# EAGLE design schematic (EAGLE 6.5.0)
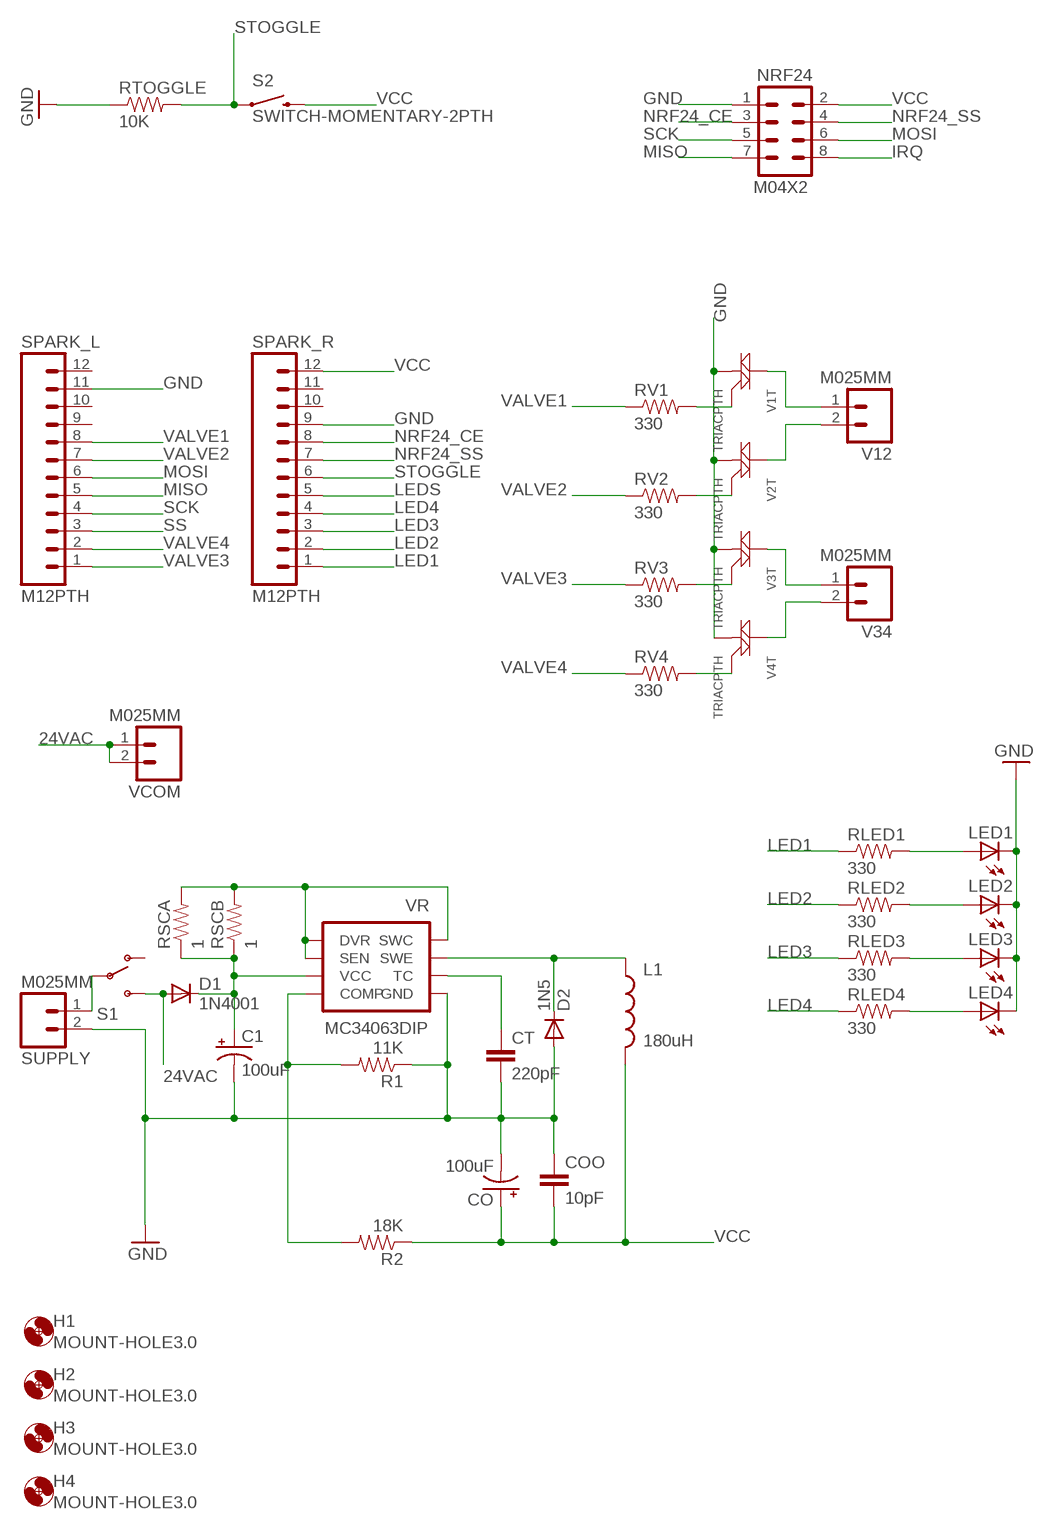
[diagram p0: schematic, sheet 1]

## Parts
C1  100uF  CPOL-USE3.5-8  [E3,5-8]
CO  100uF  CAP_POLPTH1  [CPOL-RADIAL-100UF-25V]
COO  10pF  CAPPTH1  [CAP-PTH-5MM]
CT  220pF  CAPPTH1  [CAP-PTH-5MM]
D1  1N4001  DIODEPTH  [DIODE-1N4001]
D2  1N5  DIODEPTH  [DIODE-1N4001]
H1  MOUNT-HOLE3.0  [3,0]
H2  MOUNT-HOLE3.0  [3,0]
H3  MOUNT-HOLE3.0  [3,0]
H4  MOUNT-HOLE3.0  [3,0]
L1  180uH  INDUCTORRLB0912  [RLB0912]
LED1  LED3MM  [LED3MM]
LED2  LED3MM  [LED3MM]
LED3  LED3MM  [LED3MM]
LED4  LED3MM  [LED3MM]
NRF24  M04X2  [2X4]
R1  11K  RESISTORAXIAL-0.3  [AXIAL-0.3]
R2  18K  RESISTORAXIAL-0.3  [AXIAL-0.3]
RLED1  330  RESISTORAXIAL-0.3  [AXIAL-0.3]
RLED2  330  RESISTORAXIAL-0.3  [AXIAL-0.3]
RLED3  330  RESISTORAXIAL-0.3  [AXIAL-0.3]
RLED4  330  RESISTORAXIAL-0.3  [AXIAL-0.3]
RSCA  1  RESISTORAXIAL-0.3  [AXIAL-0.3]
RSCB  1  RESISTORAXIAL-0.3  [AXIAL-0.3]
RTOGGLE  10K  RESISTORAXIAL-0.3  [AXIAL-0.3]
RV1  330  RESISTORAXIAL-0.3  [AXIAL-0.3]
RV2  330  RESISTORAXIAL-0.3  [AXIAL-0.3]
RV3  330  RESISTORAXIAL-0.3  [AXIAL-0.3]
RV4  330  RESISTORAXIAL-0.3  [AXIAL-0.3]
S1  SWITCH-SPDTPTH  [SWITCH-SPDT]
S2  SWITCH-MOMENTARY-2PTH  [TACTILE-PTH]
SPARK_L  M12PTH  [1X12]
SPARK_R  M12PTH  [1X12]
SUPPLY  M025MM  [SCREWTERMINAL-5MM-2]
V1T  TRIACPTH  [TO-92]
V2T  TRIACPTH  [TO-92]
V3T  TRIACPTH  [TO-92]
V4T  TRIACPTH  [TO-92]
V12  M025MM  [SCREWTERMINAL-5MM-2]
V34  M025MM  [SCREWTERMINAL-5MM-2]
VCOM  M025MM  [SCREWTERMINAL-5MM-2]
VR  MC34063DIP  [DIP-08]

## Nets
24VAC [24vac]: D1.A S1.3(S) VCOM.1 VCOM.2
GND [24vac]: C1.- CO.2(-) COO.1 CT.2 D2.A LED1.K(C) LED2.K(C) LED3.K(C) LED4.K(C) NRF24.1 R1.P$1 RTOGGLE.P$1 SPARK_L.11 SPARK_R.9 SUPPLY.2 V1T.1(M1) V2T.1(M1) V3T.1(M1) V4T.1(M1) VR.4(GND)
IRQ: NRF24.8
LED1: RLED1.P$1 SPARK_R.1
LED2: RLED2.P$1 SPARK_R.2
LED3: RLED3.P$1 SPARK_R.3
LED4: RLED4.P$1 SPARK_R.4
LEDS: SPARK_R.5
MISO: NRF24.7 SPARK_L.5
MOSI: NRF24.6 SPARK_L.6
N$1 [24vac]: S1.2(P) SUPPLY.1
N$2 [24vac]: V1T.3(M2) V12.1
N$3 [24vac]: C1.+ D1.C RSCA.P$1 RSCB.P$1 VR.6(VCC)
N$4: D2.C L1.1 VR.2(SWE)
N$5 [24vac]: RSCA.P$2 RSCB.P$2 VR.1(SWC) VR.7(SEN) VR.8(DVR)
N$6: CT.1 VR.3(TC)
N$8: R1.P$2 R2.P$2 VR.5(COMP)
N$11: RV1.P$2 V1T.2(G)
N$12 [24vac]: V2T.3(M2) V12.2
N$13: RV2.P$2 V2T.2(G)
N$14 [24vac]: V3T.3(M2) V34.1
N$15 [24vac]: V4T.3(M2) V34.2
N$16: RV3.P$2 V3T.2(G)
N$17: RV4.P$2 V4T.2(G)
N$18: LED1.A RLED1.P$2
N$19: LED2.A RLED2.P$2
N$20: LED3.A RLED3.P$2
N$21: LED4.A RLED4.P$2
NRF24_CE: NRF24.3 SPARK_R.8
NRF24_SS: NRF24.4 SPARK_R.7
SCK: NRF24.5 SPARK_L.4
SS: SPARK_L.3
STOGGLE: RTOGGLE.P$2 S2.1 SPARK_R.6
VALVE1: RV1.P$1 SPARK_L.8
VALVE2: RV2.P$1 SPARK_L.7
VALVE3: RV3.P$1 SPARK_L.1
VALVE4: RV4.P$1 SPARK_L.2
VCC: CO.1(+) COO.2 L1.2 NRF24.2 R2.P$1 S2.3 SPARK_R.12
Unconnected: S1.1(O) SPARK_L.9 SPARK_L.10 SPARK_L.12 SPARK_R.10 SPARK_R.11

## Library data of the parts
C1 = resistor:CPOL-US: POLARIZED CAPACITOR, American symbol
CO = SparkFun-Passives:CAP_POL: Capacitor Polarized These are standard SMD and PTH capacitors. Normally 10uF, 47uF, and 100uF in electrolytic and tantalum varieties. Always verify the external diameter of the through hole cap, it varies with capacity, voltage, and manufacturer. The EIA devices should be standard.
COO CT = SparkFun-Capacitors:CAP: Capacitor Standard 0603 ceramic capacitor, and 0.1" leaded capacitor.
D1 D2 = SparkFun-DiscreteSemi:DIODE: Diode These are standard reverse protection diodes and small signal diodes. SMA package can handle up to about 1A. SOD-323 can handle about 200mA. What the SOD-323 package when ordering, there are some mfgs out there that are 5-pin packages.
H1-H4 = holes:MOUNT-HOLE: MOUNTING HOLE with drill center marker
L1 = SparkFun-Passives:INDUCTOR: Inductors Basic Inductor/Choke - 0603 and 1206. Footprints are not proven and vary greatly between part numbers. SRN6045- 33uH, 20% 1.4A SDR0403-560KL - 56uH, 10%, 500mA RMS/740mA peak
LED1-LED4 = SparkFun-LED:LED: LEDs Standard schematic elements and footprints for 5mm, 3mm, 1206, and 0603 sized LEDs. 5mm - Spark Fun Electronics SKU : COM-00529 (and others)
NRF24 = SparkFun-Connectors:M04X2: .1" header, two rows of four.
R1 R2 RLED1-RLED4 RSCA RSCB RTOGGLE RV1-RV4 = SparkFun-Passives:RESISTOR: Resistor Basic schematic elements and footprints for 0603, 1206, and PTH resistors.
S1 = SparkFun-Electromechanical:SWITCH-SPDT: SPDT Switch Simple slide switch, Spark Fun Electronics SKU : COM-00102 DPDT SMT slide switch, AYZ0202, SWCH-08179
S2 = SparkFun-Electromechanical:SWITCH-MOMENTARY-2: Various NO switches- pushbuttons, reed, etc
SPARK_L SPARK_R = SparkFun-Connectors:M12: Header 12 Standard 12-pin 0.1" header. Use with straight break away headers (SKU : PRT-00116), right angle break away headers (PRT-00553), swiss pins (PRT-00743), machine pins (PRT-00117), and female headers (PRT-00115).
SUPPLY V12 V34 VCOM = SparkFun-Connectors:M02: Standard 2-pin 0.1" header. Use with - straight break away headers ( PRT-00116) - right angle break away headers (PRT-00553) - swiss pins (PRT-00743) - machine pins (PRT-00117) - female headers (PRT-00115) Molex polarized connector foot print use with: PRT-08233 with associated crimp pins and housings. 2.54_SCREWTERM for use with PRT-10571. 3.5mm Screw Terminal footprints for PRT-08084 5mm Screw Terminal footprints for use with PRT-08433
V1T V2T V3T V4T = SparkFun-DiscreteSemi:TRIAC: Low-power generic TRIAC packages
VR = SparkFun-PowerIC:MC34063: Jellybean switching supply controller

## Net classes
0 default: width 0.152 mm, clearance 0.152 mm
1 24vac: width 0.813 mm, clearance 0.406 mm

## Board
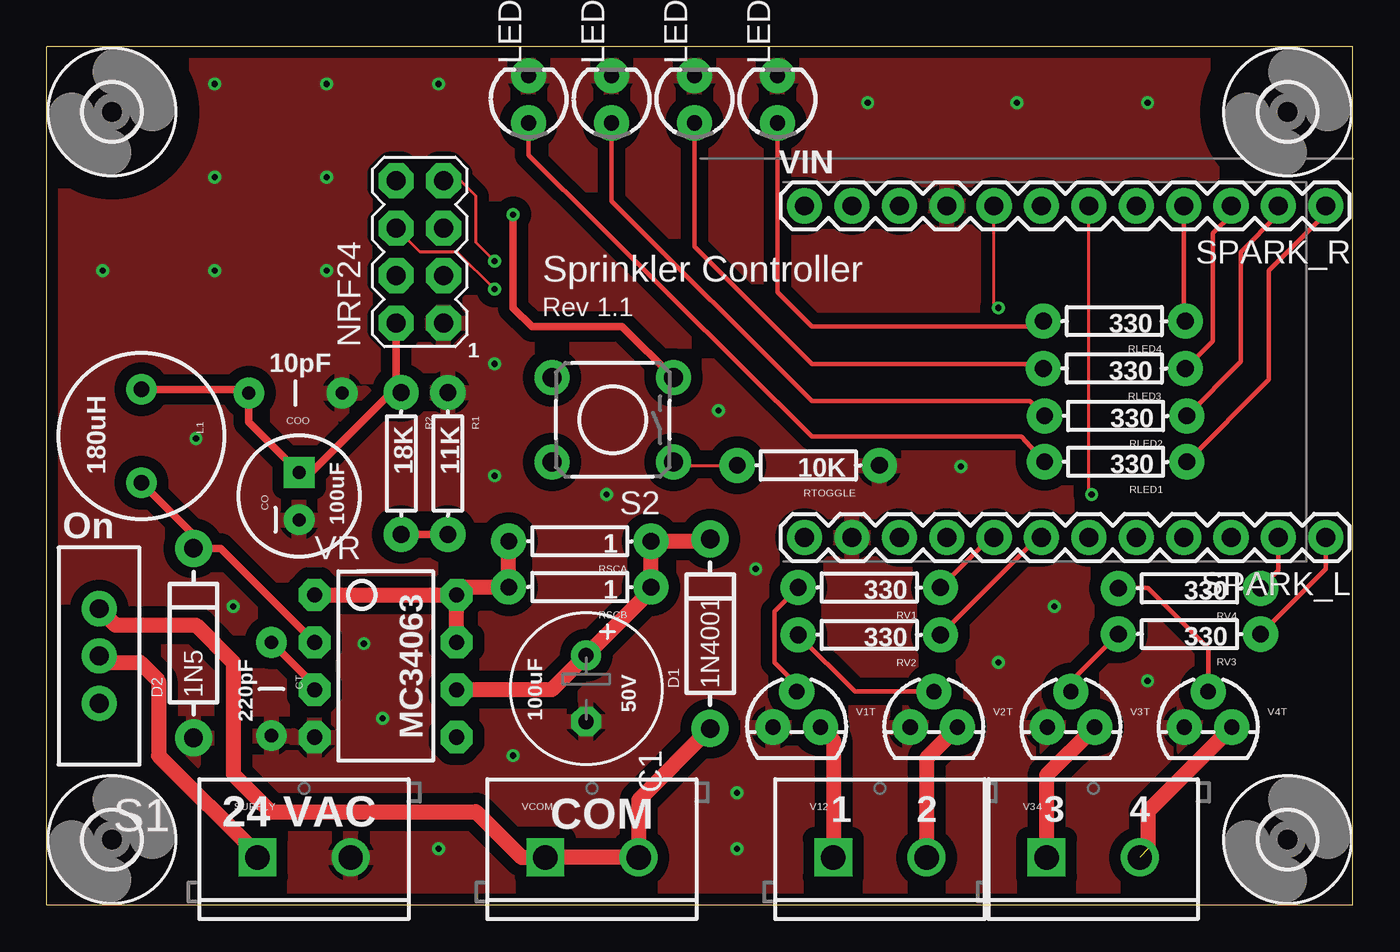
[diagram p1: board, top side]
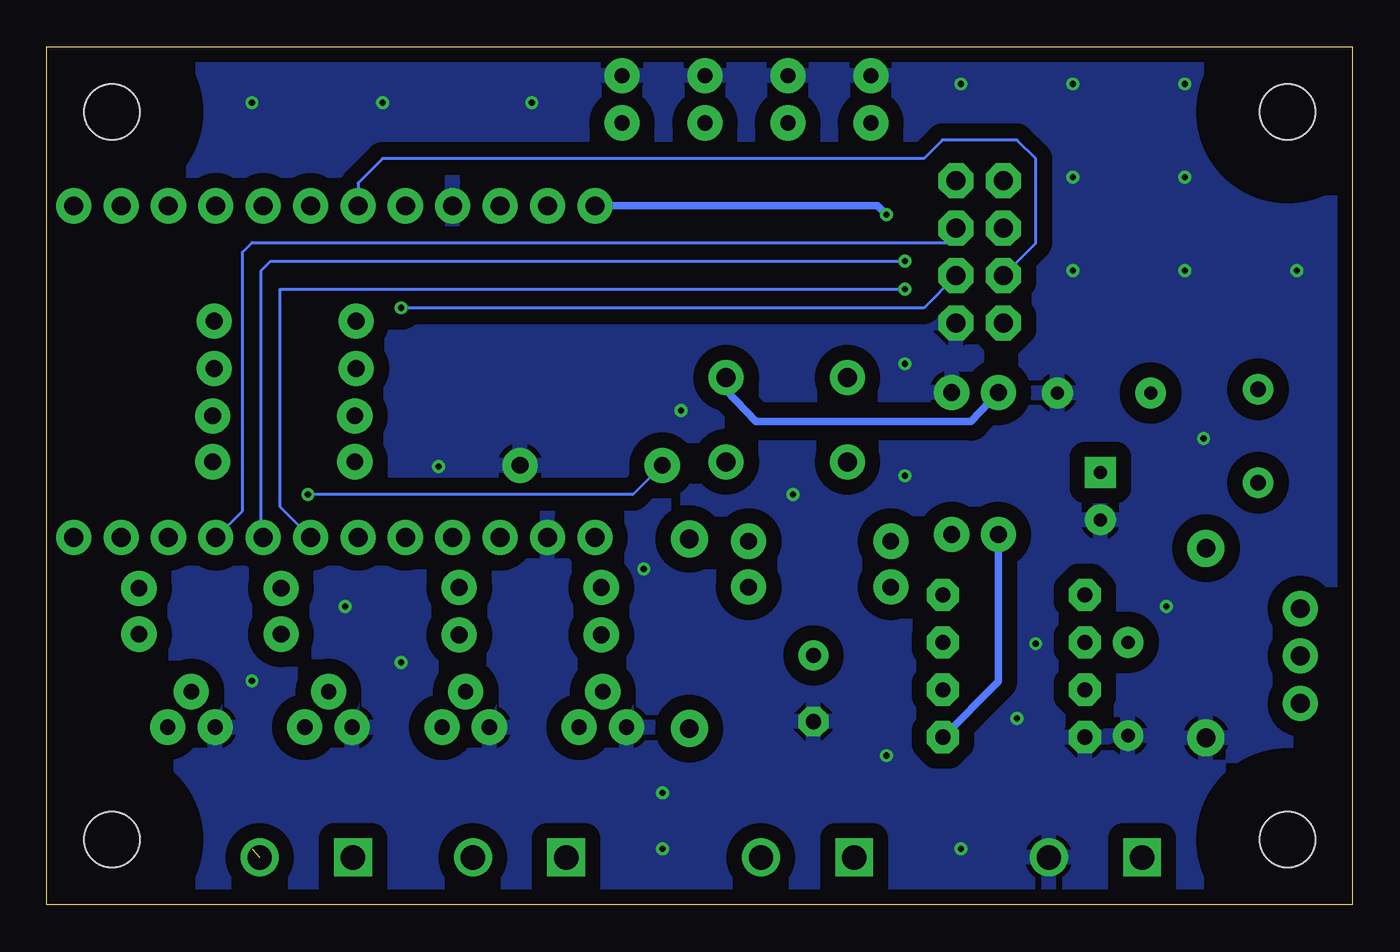
[diagram p2: board, bottom side, seen from below]

Size 70 x 46 mm. Coordinates in mm from the lower left corner, seen from the top.
Outline: 0,0 70,0 70,46 0,46 0,0
Copper layers (1*16): Top 0.0356mm / dielectric 1.5011mm / Bottom 0.0356mm
Design rules "LaenPCBOrder *": minimum track width 6mil, minimum drill 13mil, track to track 6mil, track to pad 6mil, pad to pad 6mil, via to via 6mil, smd to smd 6mil, copper to edge 15mil, drill to drill 6mil, minimum pad ring 7mil, minimum via ring 7mil, stop-mask expansion 3mil, vias tented up to drill 0mil, thermal gap 10mil

### Footprints (pad centres in the part's own frame; a part is rotated, then mirrored left to right if it is on the bottom)
E3,5-8 = drill 0.813 pad 1.6: + -1.778,0 | drill 0.813 pad 1.6 octagon: - 1.778,0
CPOL-RADIAL-100UF-25V = drill 0.7 pad 1.651 square: 1 1.27,0 | drill 0.7 pad 1.651: 2 -1.27,0
CAP-PTH-5MM = drill 0.7 pad 1.651: 1 -2.5,0; 2 2.5,0
DIODE-1N4001 = drill 1 pad 1.981: A -5.08,0; C 5.08,0
3,0 = hole 3: 0,0
RLB0912 = drill 0.813 pad 1.651: 1 2.502,0; 2 -2.502,0
LED3MM = drill 0.813 pad 1.88: A -1.27,0; K 1.27,0
2X4 = drill 1.016 pad 1.88 octagon: 1 -3.81,-1.27; 2 -3.81,1.27; 3 -1.27,-1.27; 4 -1.27,1.27; 5 1.27,-1.27; 6 1.27,1.27; 7 3.81,-1.27; 8 3.81,1.27
AXIAL-0.3 = drill 0.9 pad 1.88: P$1 -3.81,0; P$2 3.81,0
SWITCH-SPDT = drill 1.016 pad 1.88: 1 0,2.54; 2 0,0; 3 0,-2.54
TACTILE-PTH = drill 1.016 pad 1.88: 1 -3.251,2.261; 2 3.251,2.261; 3 -3.251,-2.261; 4 3.251,-2.261
1X12 = drill 1.016 pad 1.88: 1 0,0; 2 2.54,0; 3 5.08,0; 4 7.62,0; 5 10.16,0; 6 12.7,0; 7 15.24,0; 8 17.78,0; 9 20.32,0; 10 22.86,0; 11 25.4,0; 12 27.94,0
SCREWTERMINAL-5MM-2 = drill 1.3 pad 2.032 square: 1 0,0 | drill 1.3 pad 2.032: 2 5,0
TO-92 = drill 0.813 pad 1.88: 1 -1.27,0; 2 0,1.905; 3 1.27,0
DIP-08 = drill 0.813 pad 1.727 octagon: 1 -3.81,-3.81; 2 -1.27,-3.81; 3 1.27,-3.81; 4 3.81,-3.81; 5 3.81,3.81; 6 1.27,3.81; 7 -1.27,3.81; 8 -3.81,3.81

### Placement (x,y rotation side)
C1  28.91,11.6 270 top
CO  13.53,21.91 90 top
COO  13.34,27.44 180 top
CT  12.04,11.57 270 top
D1  35.56,14.53 90 top
D2  7.87,14.03 90 top
H1  3.5,3.5 0 top
H2  66.5,3.5 0 top
H3  66.5,42.5 0 top
H4  3.5,42.5 0 top
L1  5.08,25.13 270 top
LED1  25.83,43.18 90 top
LED2  30.27,43.18 90 top
LED3  34.72,43.18 90 top
LED4  39.16,43.18 90 top
NRF24  20,35 90 top
R1  21.5,23.66 270 top
R2  19,23.66 270 top
RLED1  57.29,23.75 180 top
RLED2  57.29,26.21 180 top
RLED3  57.22,28.75 180 top
RLED4  57.22,31.29 180 top
RSCA  28.57,19.49 180 top
RSCB  28.57,17.03 180 top
RTOGGLE  40.82,23.56 180 top
RV1  44.09,17.01 180 top
RV2  44.09,14.47 180 top
RV3  61.24,14.51 180 top
RV4  61.24,16.97 180 top
S1  2.81,13.34 180 top
S2  30.34,26 180 top
SPARK_L  68.56,19.68 180 top
SPARK_R  68.56,37.47 180 top
SUPPLY  11.29,2.54 0 top
V1T  40.2,9.53 0 top
V2T  47.55,9.53 0 top
V3T  54.9,9.53 0 top
V4T  62.24,9.53 0 top
V12  42.16,2.54 0 top
V34  53.59,2.54 0 top
VCOM  26.73,2.54 0 top
VR  18.16,12.8 270 top

### Tracks (layer width: path | path; a pad name or v marks a point on that pad's centre or on a via)
24VAC
  Top 0.813: D1.A 31.73,5.62 VCOM.2 VCOM.1 25.46,2.54 23,5 12,5 10,7 10,13 8,15 3.69,15 S1.3
GND  (via drill 0.33)
  other vias: 21,3 37,3 37,6 25,8 18,10 10,16 17,14 8,25 38,18 51,13 54,16 59,12 30,22 24,23 24,29 44,43 52,43 59,43 49,23.5 36,26.5 9,44 15,44 21,44 9,39 15,39 3,34 9,34 15,34
  pour Top (isolate 0.61): 69.96,0 0,0 0,46.35 69.96,46.35 69.96,36.83 60.45,36.83 60.45,20.09 69.96,20.09
  pour Bottom (isolate 0.813): 69.96,0 0,0 0,46.35 69.96,46.35 69.96,36.83 60.45,36.83 60.45,20.32 69.96,20.32
LED1
  Top 0.254: RLED1.P$1 65.5,28.15 65.5,34 68.56,37.05 SPARK_R.1
LED2
  Top 0.254: RLED2.P$1 64,29.11 64,35 66.02,37.02 SPARK_R.2
LED3
  Top 0.254: RLED3.P$1 62.5,30.22 62.5,36 63.48,36.98 SPARK_R.3
LED4
  Top 0.254: RLED4.P$1 60.94,31.39 SPARK_R.4
  Bottom 0.152: SPARK_R.4 61.03,37.47
MISO  (via drill 0.33)
  Top 0.152: v24,34.5 23,35.5 23,38 22.19,38.81 NRF24.7
  Bottom 0.152: SPARK_L.5 58.5,19.79 58.5,34 58,34.5 v24,34.5
MOSI  (via drill 0.33)
  Top 0.152: v24,33 22,35 20,35 NRF24.6
  Bottom 0.152: SPARK_L.6 57.5,21.33 57.5,33 v24,33
N$1
  Top 0.813: S1.2 3.15,13 5,13 6,12 6,8 11.29,2.71 SUPPLY.1
N$2
  Top 0.813: V1T.3 42.16,8.84 V12.1
N$3
  Top 0.813: D1.C 35.44,19.49 RSCA.P$1 RSCB.P$1 32.38,16.85 C1.+ 27.06,11.53 VR.6
N$4
  Top 0.406: L1.1 7.87,19.84 D2.C 9.31,19.11 VR.2
N$5
  Top 0.813: VR.7 VR.8 | VR.8 22.39,17.03 RSCB.P$2 RSCA.P$2 | VR.1 VR.8
N$6
  Top 0.406: CT.1 14.36,11.76 VR.3
N$8
  Top 0.406: R2.P$2 R1.P$2
  Bottom 0.406: VR.5 19,11.96 R2.P$2
N$11
  Top 0.254: RV1.P$2 39,15.73 39,13 40.2,11.8 V1T.2
N$12
  Top 0.813: V2T.3 47.16,7.87 V12.2
N$13
  Top 0.254: RV2.P$2 43.31,11.43 V2T.2
N$14
  Top 0.813: V3T.3 53.59,6.95 V34.1
N$15  (1 unrouted)
  Top 0.813: V4T.3 59,5.01 59,3
N$16
  Top 0.254: RV3.P$2 54.9,11.97 V3T.2
N$17
  Top 0.152: RV4.P$2 57.47,17
  Top 0.254: 57.47,17 59,17 62.24,13.76 V4T.2
N$18
  Top 0.254: RLED1.P$2 52.23,25.1 41,25.1 25.83,40.17 LED1.A
N$19
  Top 0.254: RLED2.P$2 52.69,27 41,27 30.27,37.73 LED2.A
N$20
  Top 0.254: RLED3.P$2 53.16,29 41,29 34.72,35.28 LED3.A
N$21
  Top 0.254: RLED4.P$2 53.12,31 41,31 39.16,32.84 LED4.A
NRF24_CE  (via drill 0.33)
  Top 0.152: v51,32 50.77,32.23 SPARK_R.8
  Bottom 0.152: NRF24.3 23,32 v51,32
NRF24_SS
  Bottom 0.152: NRF24.4 17,35.46 17,40 18,41 22,41 23,40 52,40 53.31,38.69 SPARK_R.7
SCK
  Bottom 0.152: SPARK_L.4 59.5,21.12 59.5,35 59,35.5 21.5,35.5 21.27,35.73 NRF24.5
STOGGLE  (via drill 0.33)
  Top 0.152: S2.1 33.77,23.56 RTOGGLE.P$2 | v56,22 55.85,22.14 SPARK_R.6
  Bottom 0.152: RTOGGLE.P$2 38.57,22 v56,22
VALVE1
  Top 0.152: 50.57,19.68 SPARK_L.8
  Top 0.254: RV1.P$1 50.57,19.68
VALVE2
  Top 0.254: RV2.P$1 53.11,19.68 SPARK_L.7
VALVE3
  Top 0.254: RV3.P$1 68.56,18.01 SPARK_L.1
VALVE4
  Top 0.254: RV4.P$1 66.02,17.93 SPARK_L.2
VCC  (via drill 0.33)
  Top 0.406: R2.P$1 18.73,27.73 | 18.73,27.73 NRF24.2 | L1.2 10.64,27.63 COO.2 10.84,25.88 CO.1 14.18,23.18 18.73,27.73 | S2.3 30.85,31 26,31 25,32 v25,37
  Bottom 0.406: R2.P$1 20.46,25.9 32,25.9 33.59,27.59 S2.3 | v25,37 25.46,37.47 SPARK_R.12

### Text on the board
tPlace: VIN | Sprinkler Controller | Rev 1.1 | 10pF | 1 | 180uH | On | 100uF | 220pF | 100uF | 50V | MC34063 | 24 VAC | COM | 1 | 2 | 3 | 4